# EAGLE design NMEA0183Breakout-3.0 (EAGLE 9.6.2)
Assembly variants: NMEA0183

## Sheet 1 of 4
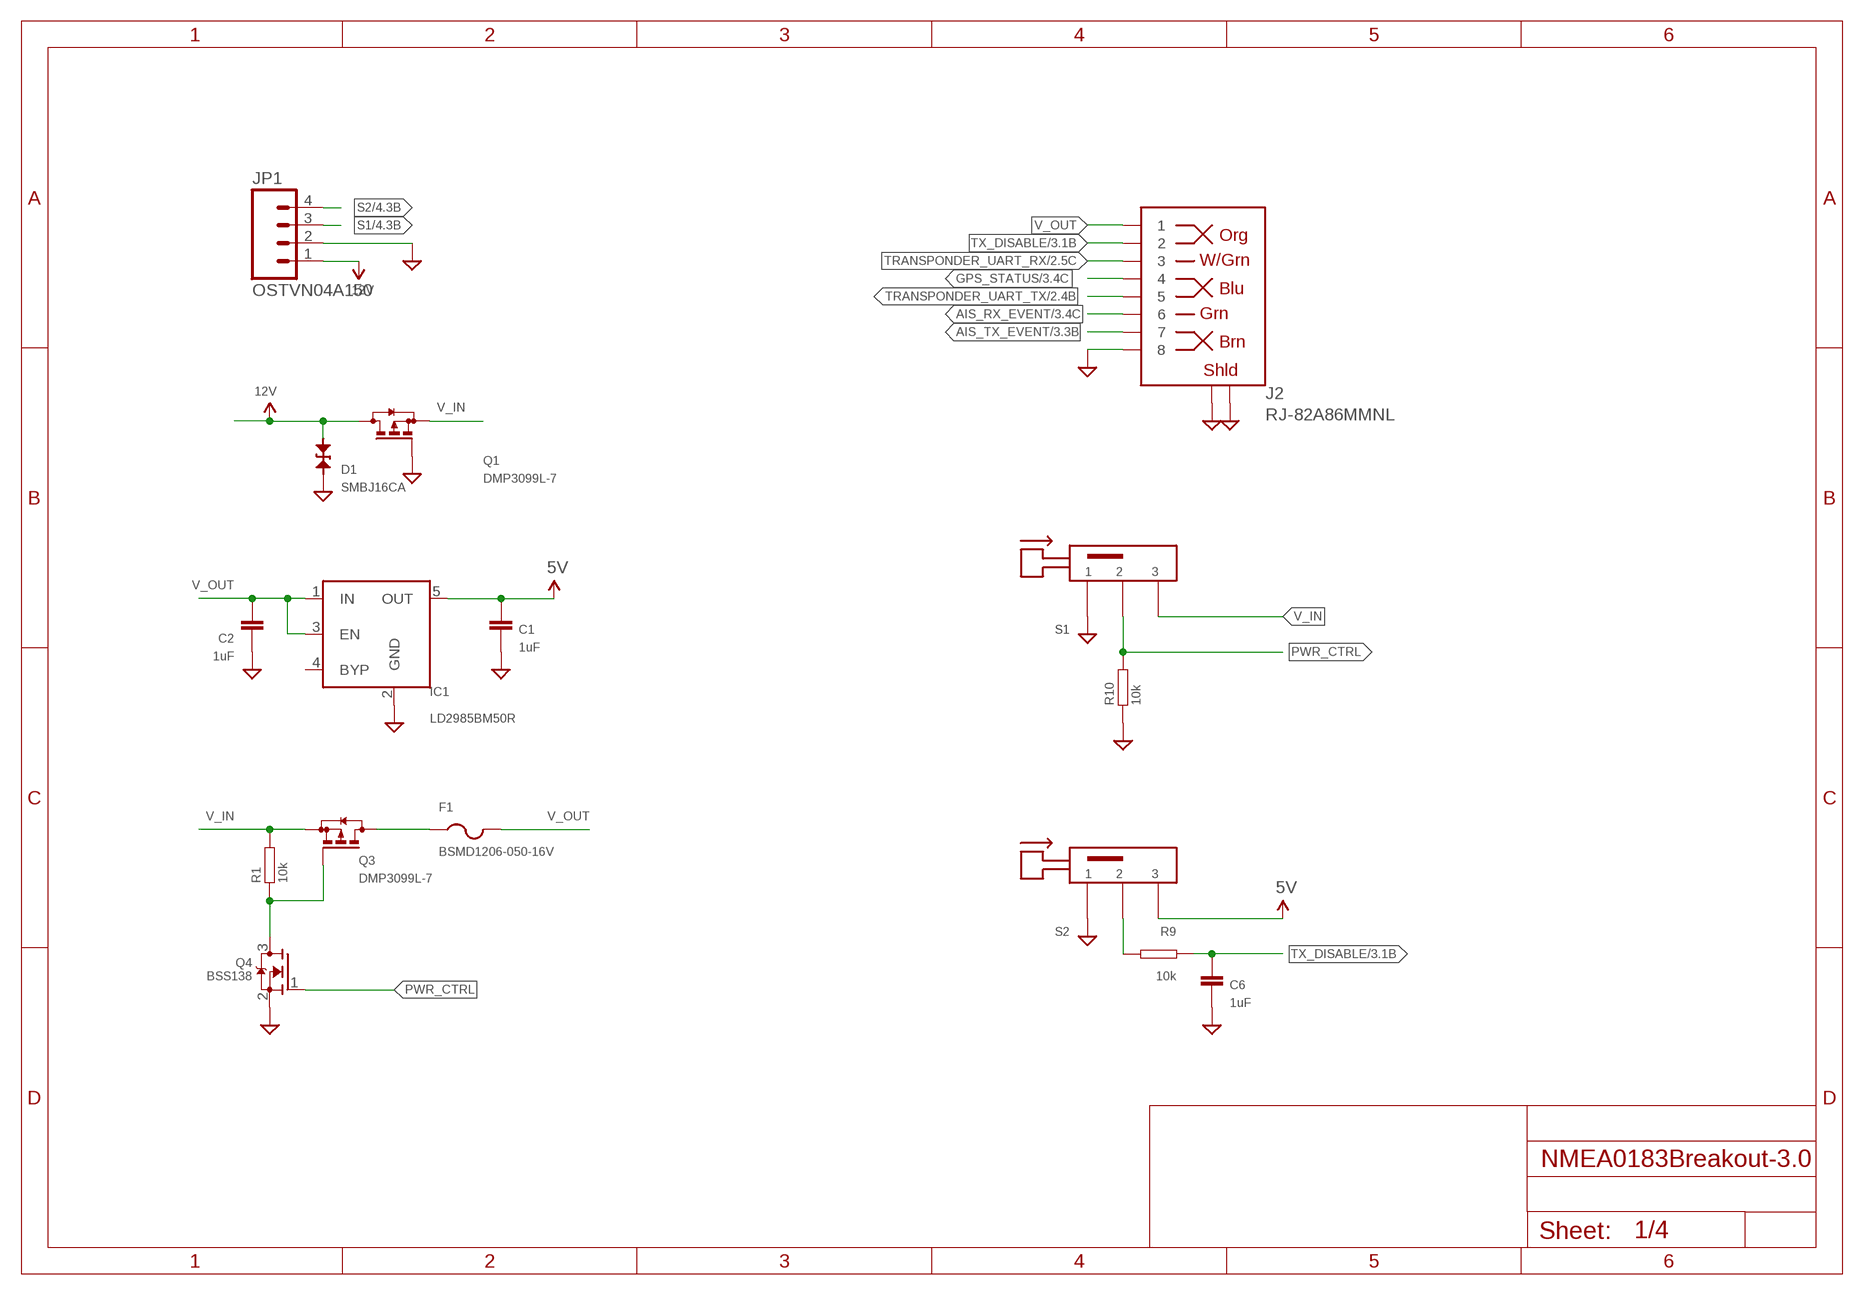
[diagram p0: schematic, sheet 1]

### Parts
C1  1uF  CAPACITOR0603  [0603]
C2  1uF  CAPACITOR0603  [0603]
C6  1uF  CAPACITOR0603  [0603]
D1  SMBJ16CA  DIODE-TVS-BIDIRSMB  [SMB-BIDIR]
F1  BSMD1206-050-16V  PTCFUSE-1206  [R1206]
IC1  LD2985BM50R  MIC5219XX  [SOT23-5]
J2  RJ-82A86MMNL  [RJ-82A86MMNL]
JP1  OSTVN04A150  M04PTH  [1X04]
Q1  DMP3099L-7  BSS84  [SOT23]
Q3  DMP3099L-7  BSS84  [SOT23]
Q4  BSS138  MOSFET-NREFLOW  [SOT23]
R1  10k  RESISTOR0603  [0603]
R9  10k  RESISTOR0603  [0603]
R10  10k  RESISTOR0603  [0603]
S1  LC1258XXNP  [LC1258XXNP]
S2  LC1258XXNP  [LC1258XXNP]

### Nets
5V: C1.P$1 IC1.5(OUT) S2.P$3 ; also sheet 3,4
12V: D1.A JP1.1 Q1.3(D)
AIS_RX_EVENT: J2.P$6 ; also sheet 3
AIS_TX_EVENT: J2.P$7 ; also sheet 3
GND: C1.P$2 C2.P$2 C6.P$2 D1.C IC1.2(GND) J2.P$8 J2.P$9(SHLD) J2.P$10(SHLD) J2.P$11(SHLD) J2.P$12(SHLD) JP1.2 Q1.1(G) Q4.2(S) R10.P$1 S1.P$1 S2.P$1 ; also sheet 2,3,4
GPS_STATUS: J2.P$4 ; also sheet 3
N$5: R9.P$2 S2.P$2
N$8: Q3.1(G) Q4.3(D) R1.P$1
N$10: F1.1 Q3.3(D)
PWR_CTRL: Q4.1(G) R10.P$2 S1.P$2
S1: JP1.3 ; also sheet 4
S2: JP1.4 ; also sheet 4
TRANSPONDER_UART_RX: J2.P$3 ; also sheet 2,4
TRANSPONDER_UART_TX: J2.P$5 ; also sheet 2,4
TX_DISABLE: C6.P$1 J2.P$2 R9.P$1 ; also sheet 3
V_IN: Q1.2(S) Q3.2(S) R1.P$2 S1.P$3
V_OUT: C2.P$1 F1.2 IC1.1(IN) IC1.3(EN) J2.P$1
Unconnected: IC1.4(BYP)

## Sheet 2 of 4
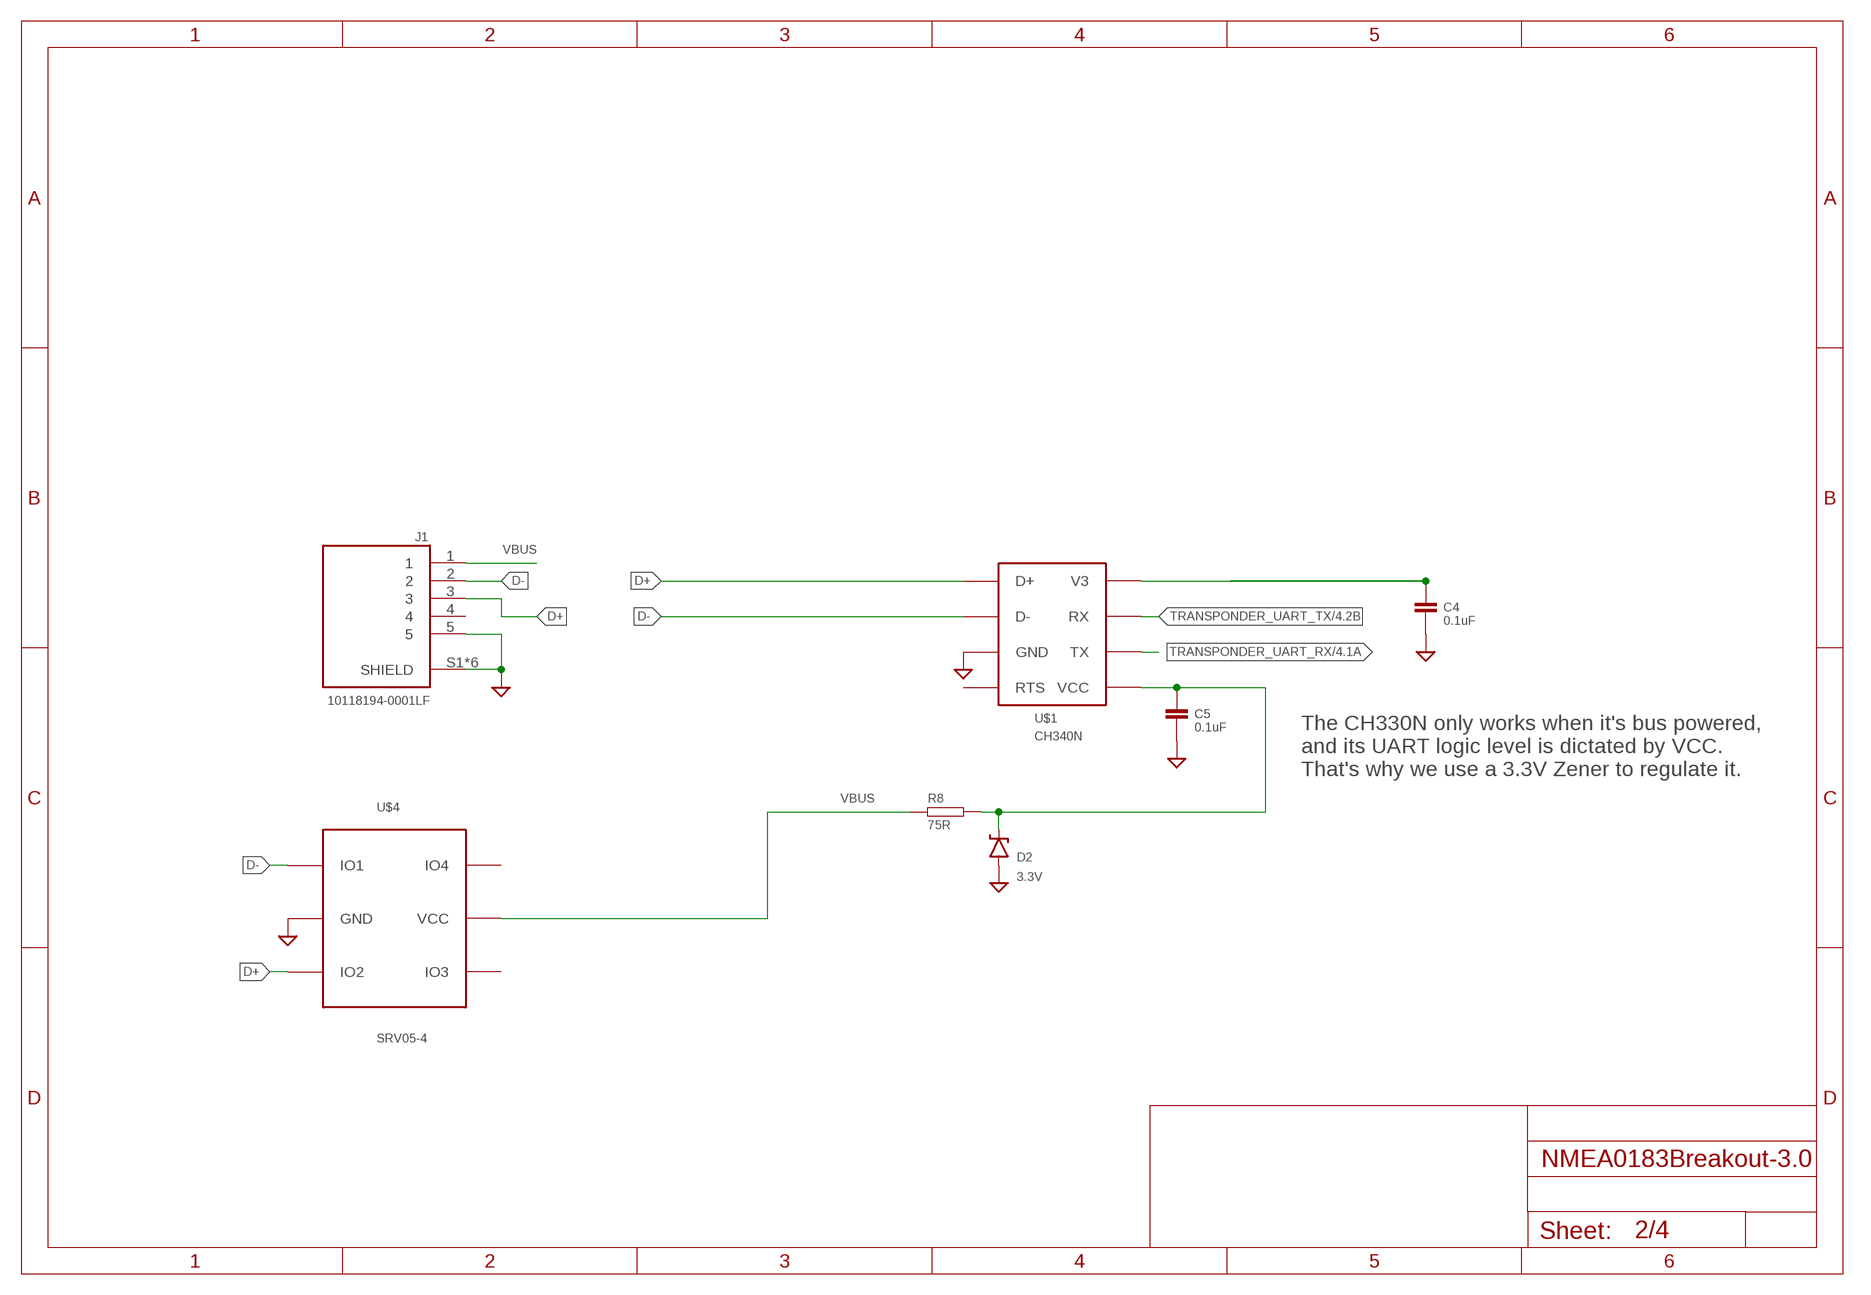
[diagram p1: schematic, sheet 2]

### Parts
C4  0.1uF  CAPACITOR0603  [0603]
C5  0.1uF  CAPACITOR0603  [0603]
D2  3.3V  DIODE-ZENER3.3V  [SOD-323]
J1  10118194-0001LF  [AMPHENOL_10118194-0001LF]
R8  75R  RESISTOR0603  [0603]
U$1  CH340N  CH330N  [SOIC-8]
U$4  SRV05-4  [SOT23-6]

### Nets
D+: J1.3 U$1.1(D+) U$4.3(IO2)
D-: J1.2 U$1.2(D-) U$4.1(IO1)
GND: C4.P$2 C5.P$2 D2.A J1.5 J1.S1(SHIELD) J1.S2(SHIELD) J1.S3(SHIELD) J1.S4(SHIELD) J1.S5(SHIELD) J1.S6(SHIELD) U$1.3(GND) U$4.2(GND) ; also sheet 1,3,4
N$1: C4.P$1 U$1.8(V3)
N$12: C5.P$1 D2.C R8.P$2 U$1.5(VCC)
TRANSPONDER_UART_RX: U$1.6(TX) ; also sheet 1,4
TRANSPONDER_UART_TX: U$1.7(RX) ; also sheet 1,4
VBUS: J1.1 R8.P$1 U$4.5(VCC)
Unconnected: J1.4 U$1.4(RTS) U$4.4(IO3) U$4.6(IO4)

### Notes on the sheet
- The CH330N only works when it's bus powered,
  and its UART logic level is dictated by VCC.
  That's why we use a 3.3V Zener to regulate it.

## Sheet 3 of 4
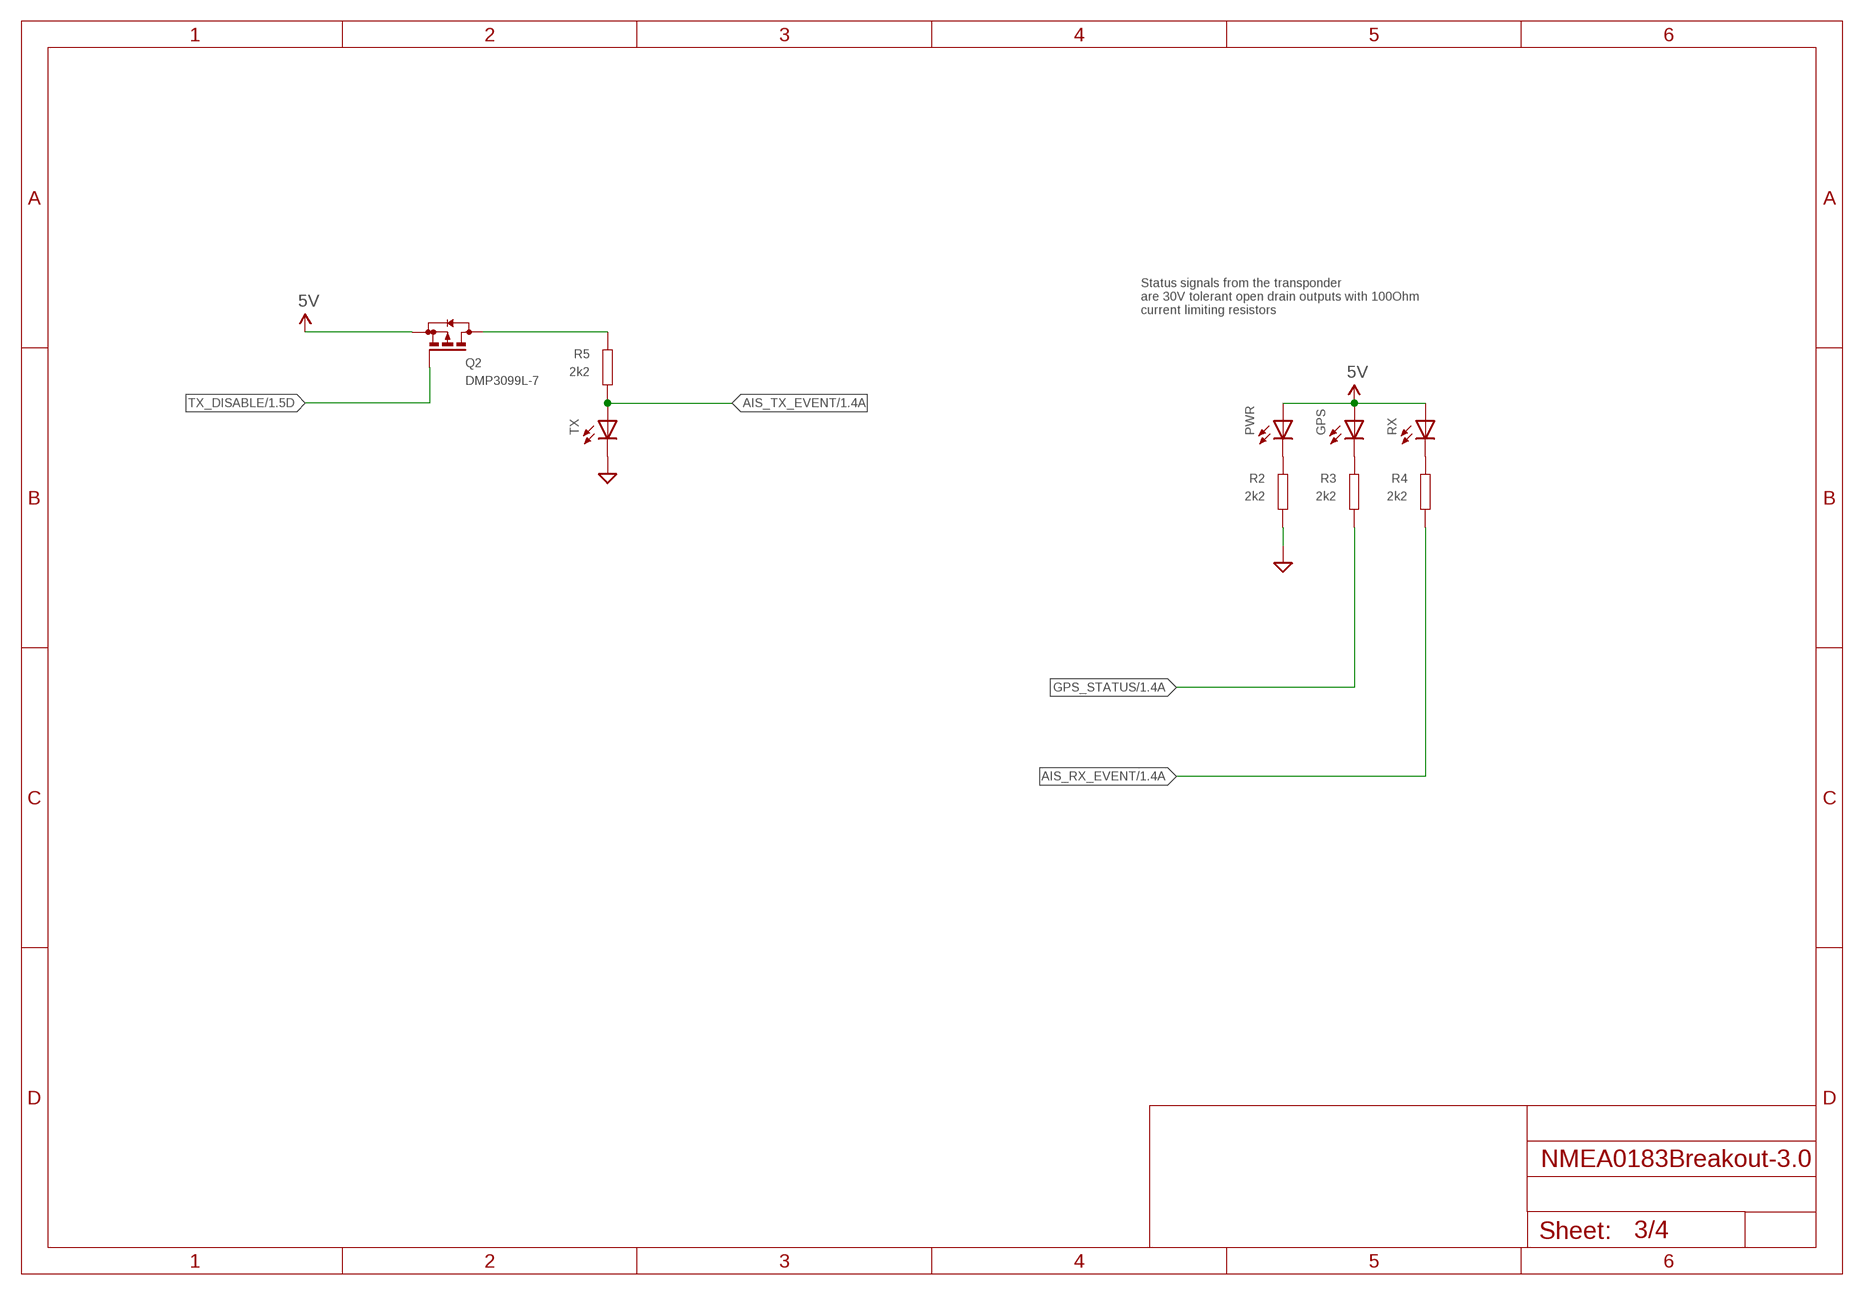
[diagram p2: schematic, sheet 3]

### Parts
GPS  LEDCHIPLED_1206  [CHIPLED_1206]
PWR  LEDCHIPLED_1206  [CHIPLED_1206]
Q2  DMP3099L-7  BSS84  [SOT23]
R2  2k2  RESISTOR0603  [0603]
R3  2k2  RESISTOR0603  [0603]
R4  2k2  RESISTOR0603  [0603]
R5  2k2  RESISTOR0603  [0603]
RX  LEDCHIPLED_1206  [CHIPLED_1206]
TX  LEDCHIPLED_1206  [CHIPLED_1206]

### Nets
5V: GPS.A PWR.A Q2.2(S) RX.A ; also sheet 1,4
AIS_RX_EVENT: R4.P$2 ; also sheet 1
AIS_TX_EVENT: R5.P$2 TX.A ; also sheet 1
GND: R2.P$2 TX.C ; also sheet 1,2,4
GPS_STATUS: R3.P$2 ; also sheet 1
N$2: PWR.C R2.P$1
N$3: GPS.C R3.P$1
N$4: R4.P$1 RX.C
N$6: Q2.3(D) R5.P$1
TX_DISABLE: Q2.1(G) ; also sheet 1

### Notes on the sheet
- Status signals from the transponder
  are 30V tolerant open drain outputs with 100Ohm 
  current limiting resistors

## Sheet 4 of 4
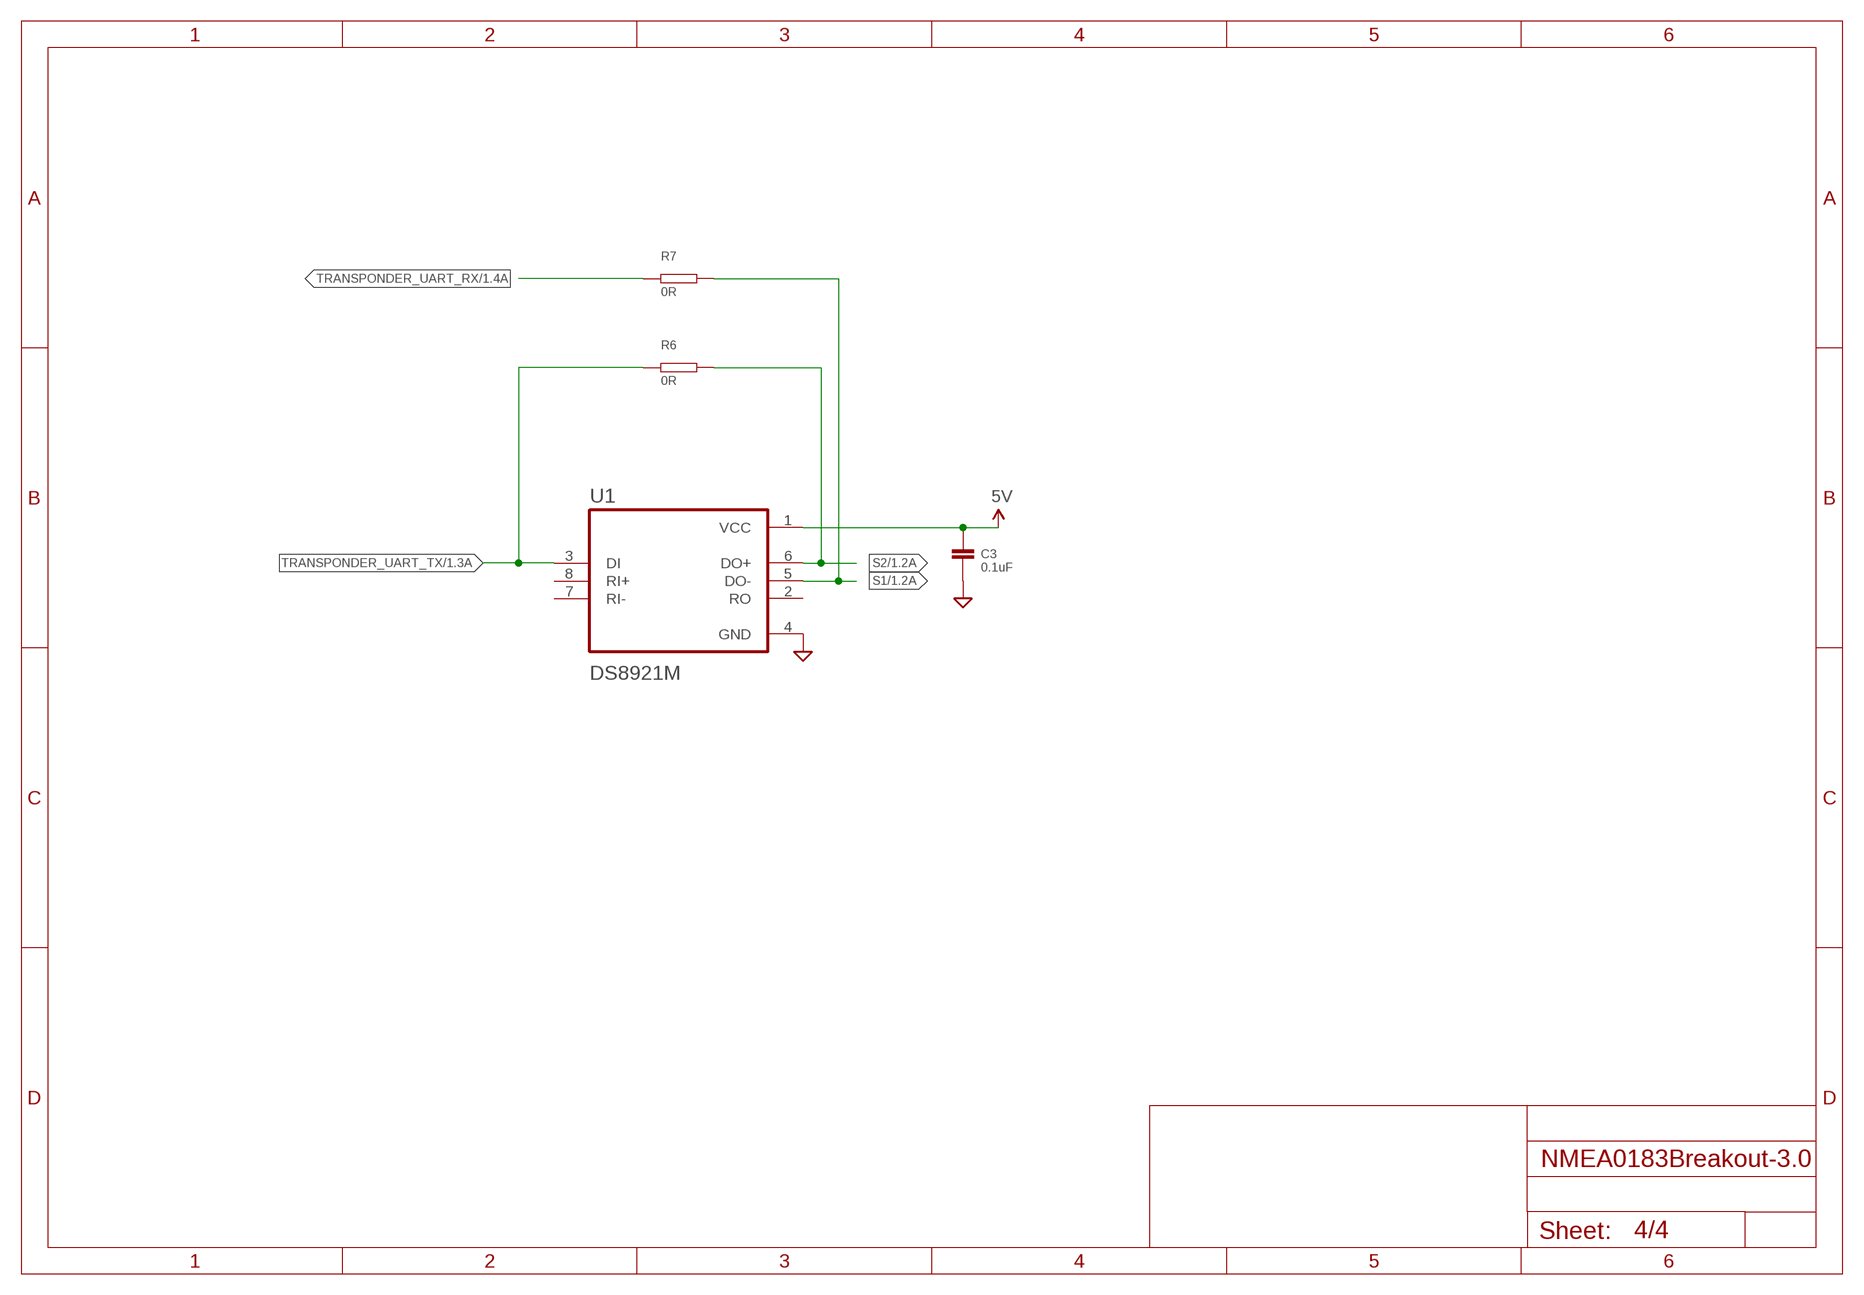
[diagram p3: schematic, sheet 4]

### Parts
C3  0.1uF  CAPACITOR0603  [0603]
R6  0R  RESISTOR0603  [0603]  (not fitted in variant NMEA0183)
R7  0R  RESISTOR0603  [0603]  (not fitted in variant NMEA0183)
U1  DS8921M  [SOIC127P599X175-8N]

### Nets
5V: C3.P$1 U1.1(VCC) ; also sheet 1,3
GND: C3.P$2 U1.4(GND) ; also sheet 1,2,3
S1: R7.P$2 U1.5(DO-) ; also sheet 1
S2: R6.P$2 U1.6(DO+) ; also sheet 1
TRANSPONDER_UART_RX: R7.P$1 ; also sheet 1,2
TRANSPONDER_UART_TX: R6.P$1 U1.3(DI) ; also sheet 1,2
Unconnected: U1.2(RO) U1.7(RI-) U1.8(RI+)

## Library data of the parts
C1-C6 = MyPassives:CAPACITOR: Standard SMD capacitor
D1 = MyDiodes:DIODE-TVS-BIDIR: Bidirectional TVS diode
D2 = SparkFun-DiscreteSemi:DIODE-ZENER: Zener Diode Production Part - 8199 3.4V Zener Voltage; PROD_ID: DIO-11284
F1 = adafruit:PTCFUSE: PTC fuses, resettable thermistors
GPS PWR RX TX = led:LED: LED OSRAM: - CHIPLED LG R971, LG N971, LY N971, LG Q971, LY Q971, LO R971, LY R971 LH N974, LH R974 LS Q976, LO Q976, LY Q976 LO Q996 - Hyper CHIPLED LW Q18S LB Q993, LB Q99A, LB R99A - SideLED LS A670, LO A670, LY A670, LG A670, LP A670 LB A673, LV A673, LT A673, LW A673 LH A674 LY A675 LS A676, LA A676, LO A676, LY A676, LW A676 LS A679, LY A679, LG A679 - Hyper Micro SIDELED® LS Y876, LA Y876, LO Y876, LY Y876 LT Y87S - SmartLED LW L88C, LW L88S LB L89C, LB L89S, LG L890 LS L89K, LO L89K, LY L89K LS L896, LA L896, LO L896, LY L896 - TOPLED LS T670, LO T670, LY T670, LG T670, LP T670 LSG T670, LSP T670, LSY T670, LOP T670, LYG T670 LG T671, LOG T671, LSG T671 LB T673, LV T673, LT T673, LW T673 LH T674 LS T676, LA T676, LO T676, LY T676, LB T676, LH T676, LSB T676, LW T676 LB T67C, LV T67C, LT T67C, LS T67K, LO T67K, LY T67K, LW E67C LS E67B, LA E67B, LO E67B, LY E67B, LB E67C, LV E67C, LT E67C LW T67C LS T679, LY T679, LG T679 LS T770, LO T770, LY T770, LG T770, LP T770 LB T773, LV T773, LT T773, LW T773 LH T774 LS E675, LA E675, LY E675, LS T675 LS T776, LA T776, LO T776, LY T776, LB T776 LHGB T686 LT T68C, LB T68C - Hyper Mini TOPLED® LB M676 - Mini TOPLED Santana® LG M470 LS M47K, LO M47K, LY M47K Source: http://www.osram.convergy.de LUXEON: - LUMILED® LXK2-PW12-R00, LXK2-PW12-S00, LXK2-PW14-U00, LXK2-PW14-V00 LXK2-PM12-R00, LXK2-PM12-S00, LXK2-PM14-U00 LXK2-PE12-Q00, LXK2-PE12-R00, LXK2-PE12-S00, LXK2-PE14-T00, LXK2-PE14-U00 LXK2-PB12-K00, LXK2-PB12-L00, LXK2-PB12-M00, LXK2-PB14-N00, LXK2-PB14-P00, LXK2-PB14-Q00 LXK2-PR12-L00, LXK2-PR12-M00, LXK2-PR14-Q00, LXK2-PR14-R00 LXK2-PD12-Q00, LXK2-PD12-R00, LXK2-PD12-S00 LXK2-PH12-R00, LXK2-PH12-S00 LXK2-PL12-P00, LXK2-PL12-Q00, LXK2-PL12-R00 Source: www.luxeon.com KINGBRIGHT: KA-3528ASYC Source: www.kingbright.com; PARTNO: TJ-S3216CL9T5ALC2G-A5
IC1 = v-reg-micrel:MIC5219XX: VOLTAGE REGULATOR; OC_FARNELL: unknown; OC_NEWARK: unknown
J1 = 10118194-0001LF:10118194-0001LF: Micro Usb, 2.0 Type b, Rcpt, Smt Check prices <https://snapeda.com/parts/10118194-0001LF/Amphenol%20ICC%20%28FCI%29/view-part/?ref=eda>; ARROW_ELECTRONICS-PURCHASE-URL: https://snapeda.com/shop?store=Arrow+Electronics&id=4816633; AVAILABILITY: Good; DESCRIPTION: USB - micro B USB 2.0 Receptacle Connector 5 Position Surface Mount, Right Angle; Through Hole; DIGIKEY-PURCHASE-URL: https://snapeda.com/shop?store=DigiKey&id=4816633; MF: Amphenol ICC (FCI); MOUSER-PURCHASE-URL: https://snapeda.com/shop?store=Mouser&id=4816633; MP: 10118194-0001LF; PACKAGE: None; PRICE: None
J2 = xyfw:RJ-82A86MMNL: Mid-mount RJ45 jack; PARTNO: RJ-82A86MMNL
JP1 = SparkFun-Connectors:M04: Header 4 Standard 4-pin 0.1" header. Use with straight break away headers (SKU : PRT-00116), right angle break away headers (PRT-00553), swiss pins (PRT-00743), machine pins (PRT-00117), and female headers (PRT-00115). Molex polarized connector foot print use with SKU : PRT-08231 with associated crimp pins and housings. 1MM SMD Version SKU: PRT-10208
Q1-Q3 = transistor-small-signal:BSS84: P-CHANNEL MOS FET
Q4 = adafruit:MOSFET-N: N-Channel Mosfet 2N7002E - 60V 260mA SOT23 [Digikey: 2N7002ET1GOSTR-ND] - REEL BSH103 - 30V 850mA SOT23 [Digikey: 568-5013-1-ND]
R1-R10 = MyPassives:RESISTOR: Standard SMD resistor
S1 S2 = e-switch:LC1258XXNP: E-Switch SPDT pushbutton
U1 = DS8921M:DS8921M: Check prices <https://pricing.snapeda.com/parts/DS8921M/NOPB/Texas%20Instruments/view-part?ref=eda>; AVAILABILITY: In Stock; DESCRIPTION: Differential Line Drivers and Receiver Pair 8-SOIC 0 to 70; MF: Texas Instruments; MP: DS8921M/NOPB; PACKAGE: SOIC-8 Texas Instruments; PRICE: None; PURCHASE-URL: https://pricing.snapeda.com/search/part/DS8921M/NOPB/?ref=eda
U$1 = JiangsuQinHeng:CH330N: USB to UART bridge; PARTNO: CH340N
U$4 = yenji:SRV05-4: Low Capacitance TVS Diode Array

## Board
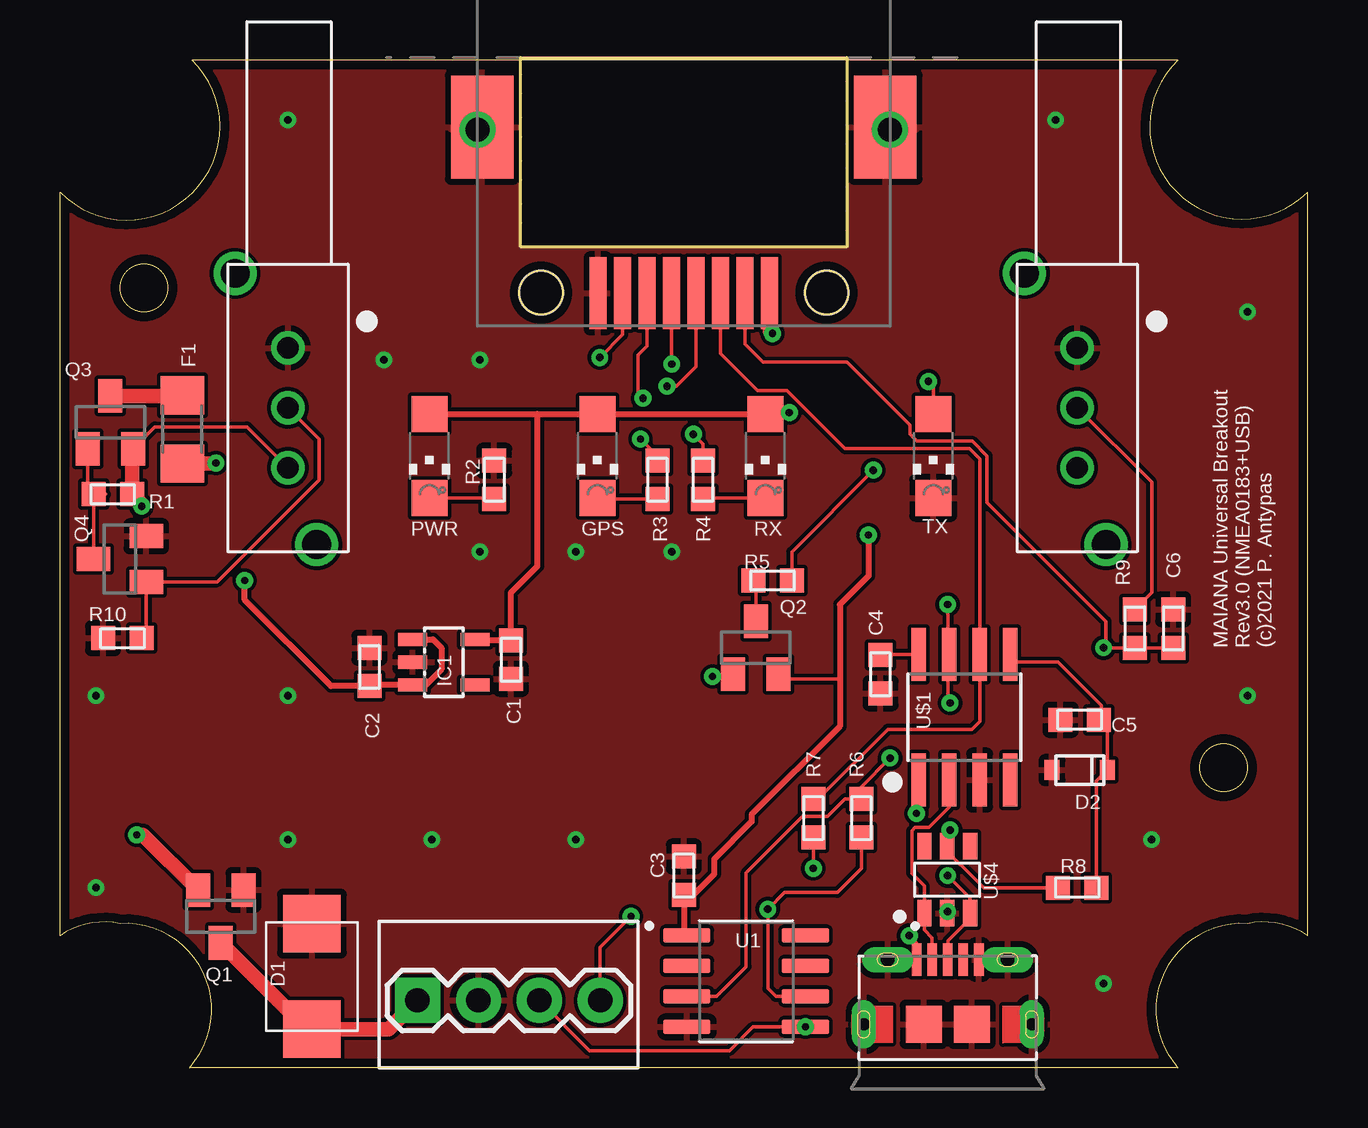
[diagram p4: board, top side]
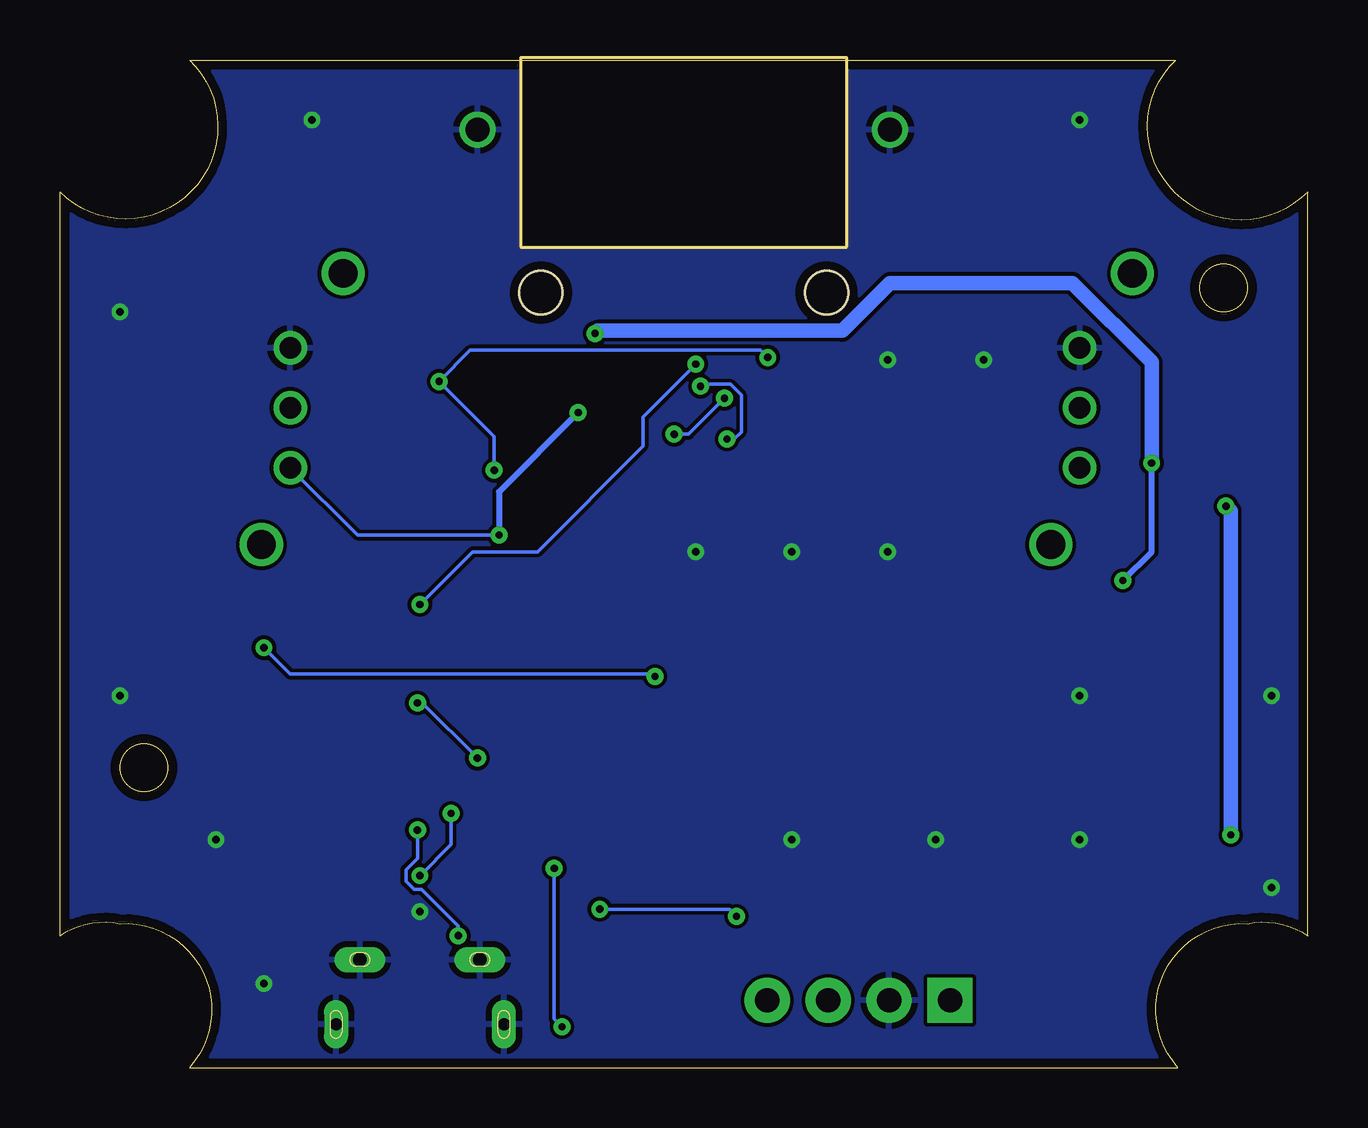
[diagram p5: board, bottom side, seen from below]

Size 52 x 42 mm. Coordinates in mm from the lower left corner, seen from the top.
Outline: 46.6,0 5.4,0 arc136 2.5,6 arc46 0,5.5 0,36.5 arc181 5.5,42 46.6,42 arc181 52,36.5 52,5.5 arc46 49.5,6 arc136 46.6,0
Outline: circle at 3.5,32.5 radius 1
Outline: circle at 48.5,12.5 radius 1
Copper layers (1*16): Top 0.035mm / dielectric 1.5mm / Bottom 0.035mm
Design rules "default *": minimum track width 6mil, minimum drill 0.3mm, track to track 6mil, track to pad 6mil, pad to pad 6mil, via to via 6mil, smd to smd 0mil, copper to edge 15mil, drill to drill 6mil, minimum pad ring 10mil, minimum via ring 8mil, stop-mask expansion 1mil, vias tented up to drill 20mil, thermal gap 10mil

### Footprints (pad centres in the part's own frame; a part is rotated, then mirrored left to right if it is on the bottom)
0603 = smd 1 x 1: P$1 -0.8,0; P$2 0.8,0
SMB-BIDIR = smd 2.4 x 2.4: A 2.2,0; C -2.2,0
SOD-323 = smd 0.63 x 0.83: A 1.15,0; C -1.15,0
R1206 = smd 1.6 x 1.803: 1 -1.422,0; 2 1.422,0
CHIPLED_1206 = smd 1.5 x 1.5: A 0,-1.75; C 0,1.75
SOT23-5 = smd 0.55 x 1.2: 1 -0.95,-1.3; 2 0,-1.3; 3 0.95,-1.3; 4 0.95,1.3; 5 -0.95,1.3
AMPHENOL_10118194-0001LF = smd 0.4 x 1.35: 1 -1.3,2.7; 2 -0.65,2.7; 3 0,2.7; 4 0.65,2.7; 5 1.3,2.7 | drill 0.55 pad 0.65 long: S1 -2.5,2.7; S2 2.5,2.7 | drill 0.5 pad 0.775 long: S3 -3.5,0; S6 3.5,0 | smd 1.5 x 1.55: S4 -1,0; S5 1,0
RJ-82A86MMNL = smd 0.7 x 3: P$1 -3.57,3.82; P$2 -2.55,3.82; P$3 -1.53,3.82; P$4 -0.51,3.82; P$5 0.51,3.82; P$6 1.53,3.82; P$7 2.55,3.82; P$8 3.57,3.82 | smd 2.6 x 4.3: P$9 -8.4,-3.1; P$10 8.4,-3.1 | drill 1: P$11 -8.6,-3; P$12 8.6,-3 | hole 1.8: -5.95,3.8; 5.95,3.8
1X04 = drill 1.016 pad 1.88 square: 1 0,0 | drill 1.016 pad 1.88: 2 2.54,0; 3 5.08,0; 4 7.62,0
SOT23 = smd 1 x 1.4: 1 -0.95,-1.1; 2 0.95,-1.1; 3 0,1.1
LC1258XXNP = drill 0.9: P$1 2.5,0; P$2 0,0; P$3 -2.5,0 | drill 1.2: P$4 -5.7,-1.2; P$5 5.6,2.2
SOIC127P599X175-8N = smd 1.97 x 0.6: 1 -2.47,1.905; 2 -2.47,0.635; 3 -2.47,-0.635; 4 -2.47,-1.905; 5 2.47,-1.905; 6 2.47,-0.635; 7 2.47,0.635; 8 2.47,1.905
SOIC-8 = smd 2.21 x 0.61: 1 -2.616,1.905; 2 -2.616,0.635; 3 -2.616,-0.635; 4 -2.616,-1.905; 5 2.616,-1.905; 6 2.616,-0.635; 7 2.616,0.635; 8 2.616,1.905
SOT23-6 = smd 1.1 x 0.6: 1 -1.37,0.97; 2 -1.37,0.02; 3 -1.37,-0.93; 4 1.43,-0.93; 5 1.43,0.02; 6 1.43,0.97

### Placement (x,y rotation side)
C1  18.8,17 270 top
C2  12.9,16.7 90 top
C3  26,8 90 top
C4  34.2,16.4 270 top
C5  42.5,14.5 180 top
C6  46.4,18.3 90 top
D1  10.5,3.8 270 top
D2  42.5,12.4 180 top
F1  5.1,26.6 270 top
GPS  22.4,25.5 180 top
IC1  16,16.9 270 top
J1  37,1.8 0 top
J2  26,36.1 180 top
JP1  14.9,2.8 0 top
PWR  15.4,25.5 180 top
Q1  6.7,6.3 180 top
Q2  29,17.5 0 top
Q3  2.1,26.9 0 top
Q4  2.5,21.2 90 top
R1  2.2,23.9 0 top
R2  18.1,24.5 90 top
R3  24.9,24.5 90 top
R4  26.8,24.5 90 top
R5  29.7,20.3 0 top
R6  33.4,10.4 270 top
R7  31.4,10.4 270 top
R8  42.4,7.5 0 top
R9  44.8,18.3 90 top
R10  2.6,17.9 0 top
RX  29.4,25.5 180 top
S1  9.5,27.5 90 top
S2  42.4,27.5 90 top
TX  36.4,25.5 180 top
U1  28.6,3.6 0 top
U$1  37.7,14.6 90 top
U$4  37,7.8 90 top

### Tracks (layer width: path | path; a pad name or v marks a point on that pad's centre or on a via)
5V  (via drill 0.3)
  Top 0.152: 17.35,17.8 IC1.5 | RX.A 29.45,27.3 v30.4,27.3 | 26,5.63 U1.1 | Q2.2 30.15,16.2 32.5,16.2
  Top 0.254: PWR.A 19.9,27.25 | 19.9,27.25 GPS.A RX.A | v33.7,22.2 33.7,20.5 32.5,19.3 32.5,16.2 32.5,14.22 28.83,10.55 28.83,10.25 27.27,8.7 27.27,8.07 26.4,7.2 C3.P$1 26,5.63 | 17.35,17.8 C1.P$1 18.8,19.8 19.9,20.9 19.9,27.25
  Bottom 0.152: S2.P$3 39.6,22.2 v33.7,22.2
  Bottom 0.254: v30.4,27.3 33.7,24 v33.7,22.2
12V
  Top 0.61: JP1.1 13.7,1.6 D1.A 10.3,1.6 Q1.3
AIS_RX_EVENT  (via drill 0.3)
  Top 0.152: J2.P$6 24.47,30.07 24.1,29.7 24.1,28.1 v24.3,27.9 | v26.4,26.4 26.8,26 R4.P$2
  Bottom 0.152: v24.3,27.9 25.8,26.4 v26.4,26.4
AIS_TX_EVENT  (via drill 0.3)
  Top 0.152: J2.P$7 23.45,30.55 v22.5,29.6 | v36.2,28.6 36.4,28.4 TX.A | R5.P$2 30.5,21.5 v33.9,24.9
  Bottom 0.152: v22.5,29.6 22.8,29.9 34.9,29.9 v36.2,28.6 33.9,26.3 v33.9,24.9
D+  (via drill 0.3)
  Top 0.152: J1.3 37,5.28 37.91,6.18 37.91,6.41 U$4.3 37.93,7.07 v37,8 | v35.7,10.59 35.8,10.69 U$1.1
  Bottom 0.152: v37,8 35.7,9.3 v35.7,10.59
D-
  Top 0.152: J1.2 36.35,5.41 36.03,5.73 U$4.1 36.03,7.57 35.5,8.1 35.5,9.87 35.63,10.01 36.21,10.01 37.06,10.87 U$1.2
GND  (via drill 0.3)
  other vias: 37,6.5 9.5,9.5 15.5,9.5 21.5,9.5 45.5,9.5 43.5,3.5 49.5,15.5 49.5,31.5 41.5,39.5 9.5,39.5 9.5,15.5 1.5,7.5 1.5,15.5 17.5,29.5 13.5,29.5 17.5,21.5 21.5,21.5 25.5,21.5
  pour Top: -1.5,43.5 53.5,43.5 53.5,-2.5 -1.5,-2.5
  pour Bottom: -2.5,44.5 54.5,44.5 54.5,-3.5 -2.5,-3.5
GPS_STATUS  (via drill 0.3)
  Top 0.152: J2.P$4 26.51,29.21 25.7,28.4 v25.3,28.4 | v24.2,26.2 24.9,25.5 R3.P$2
  Bottom 0.152: v25.3,28.4 25.22,28.48 24.06,28.48 23.6,28.02 23.6,26.5 23.9,26.2 v24.2,26.2
N$1
  Top 0.152: U$1.8 34.22,17.22 C4.P$1
N$2
  Top 0.152: PWR.C 18.05,23.75 R2.P$1
N$3
  Top 0.152: R3.P$1 22.45,23.7 GPS.C
N$4
  Top 0.152: RX.C 26.85,23.75 R4.P$1
N$5
  Top 0.152: R9.P$2 45.5,19.8 45.5,24.4 S2.P$2
N$6
  Top 0.152: R5.P$1 29,20.2 Q2.3
N$8
  Top 0.152: Q3.1 1.15,24.15 1.3,24 | 1.3,24 R1.P$1 | Q4.3 1.4,23.4 1.9,23.9 1.8,24 1.3,24
N$10
  Top 0.61: Q3.3 5.08,28 F1.1
N$12
  Top 0.152: C5.P$1 43.4,14.4 | 43.4,14.4 43.65,14.15 D2.C 43.2,11.95 R8.P$2 | U$1.5 39.92,16.9 41.6,16.9 43.4,15.1 43.4,14.4
PWR_CTRL
  Top 0.152: R10.P$2 3.6,18.1 Q4.1 6.55,20.25 10.8,24.5 10.8,26.2 S1.P$2
S1  (via drill 0.3)
  Top 0.152: U1.5 28.89,1.69 27.9,0.7 22.08,0.7 JP1.3 | R7.P$2 v31.4,8.3
  Bottom 0.152: v31.4,8.3 31.4,2.02 U1.5
  other vias: 31.07,1.69
S2  (via drill 0.3)
  Top 0.152: U1.6 29.84,2.96 29.5,3.3 v29.5,6.6 30.2,7.3 32.4,7.3 33.4,8.3 R6.P$2 | JP1.4 22.52,5.02 v23.8,6.3
  Bottom 0.152: v23.8,6.3 24.1,6.6 v29.5,6.6
TRANSPONDER_UART_RX
  Top 0.152: J2.P$3 27.53,29.77 29.07,28.23 30.29,28.23 32.72,25.8 37.9,25.8 38.34,25.36 U$1.6 38.34,14.44 38,14.1 34.5,14.1 31.6,11.2 R7.P$1
TRANSPONDER_UART_TX  (via drill 0.3)
  Top 0.152: J2.P$5 v25.49,29.33 v25.5,29.32 | v37,19.3 37,17.28 | 37,17.28 U$1.7 | U1.3 27.36,2.96 28.6,4.2 28.6,8.12 30.95,10.47 31.99,10.47 32.72,11.2 R6.P$1 33.4,11.7 v34.6,12.9 | v37.1,15.2 37,15.3 37,17.28
  Bottom 0.152: v25.5,29.32 27.7,27.12 27.7,25.9 32.1,21.5 34.8,21.5 v37,19.3 | v34.6,12.9 36.9,15.2 v37.1,15.2
TX_DISABLE  (via drill 0.3)
  Top 0.152: J2.P$2 28.55,30.15 29.3,29.4 32.8,29.4 35.42,26.78 35.42,26.41 35.72,26.11 38.03,26.11 38.64,25.49 38.64,23.56 43.6,18.6 43.6,17.5 | C6.P$1 R9.P$1 43.6,17.5 | 43.6,17.5 v43.5,17.5 | Q2.1 27.95,16.3 v27.2,16.3
  Bottom 0.152: v43.5,17.5 42.4,16.4 27.3,16.4 v27.2,16.3
V_IN  (via drill 0.3)
  Top 0.152: Q3.2 3.95,26.7 7.8,26.7 S1.P$3
  Top 0.61: Q1.2 3.45,9.7 v3.2,9.7 | v3.4,23.4 3.4,23.5 R1.P$2 3,25.75 Q3.2
  Bottom 0.61: v3.2,9.7 3.2,23.2 v3.4,23.4
V_OUT  (via drill 0.3)
  Top 0.152: 12.95,15.95 C2.P$1 | 15.25,15.95 IC1.3
  Top 0.254: IC1.1 15.55,17.85 15.9,17.5 15.9,16.6 15.25,15.95 | IC1.3 12.95,15.95 | C2.P$1 11.3,15.9 7.7,19.5 v7.7,20.3
  Top 0.61: F1.2 6.48,25.18 v6.5,25.2 | v29.7,30.6 29.6,30.7 29.6,32.25 J2.P$1
  Bottom 0.254: v7.7,20.3 6.5,21.5 v6.5,25.2
  Bottom 0.61: v6.5,25.2 6.5,29.4 9.8,32.7 17.4,32.7 19.39,30.71 29.59,30.71 v29.7,30.6
VBUS  (via drill 0.3)
  Top 0.152: J1.1 35.7,5.2 v35.4,5.5 | v37.1,9.9 37.1,9.35 U$4.5 36.98,9.01 37.53,8.45 37.55,8.45 38.5,7.5 R8.P$1
  Bottom 0.152: v35.4,5.5 35.4,5.9 36.92,7.42 37.24,7.42 37.58,7.76 37.58,8.24 37.1,8.72 v37.1,9.9

### Text on the board
tNames: MAIANA Universal Breakout / Rev3.0 (NMEA0183+USB) / (c)2021 P. Antypas